# Altium schematic sheet S7CAS-PLEIADES-CARTE-MERE_P20_PLL.SchDoc
size Tabloid; SheetNumber: 14; SheetTotal: 20; Sheet_Name: PLL; Size: 11x17
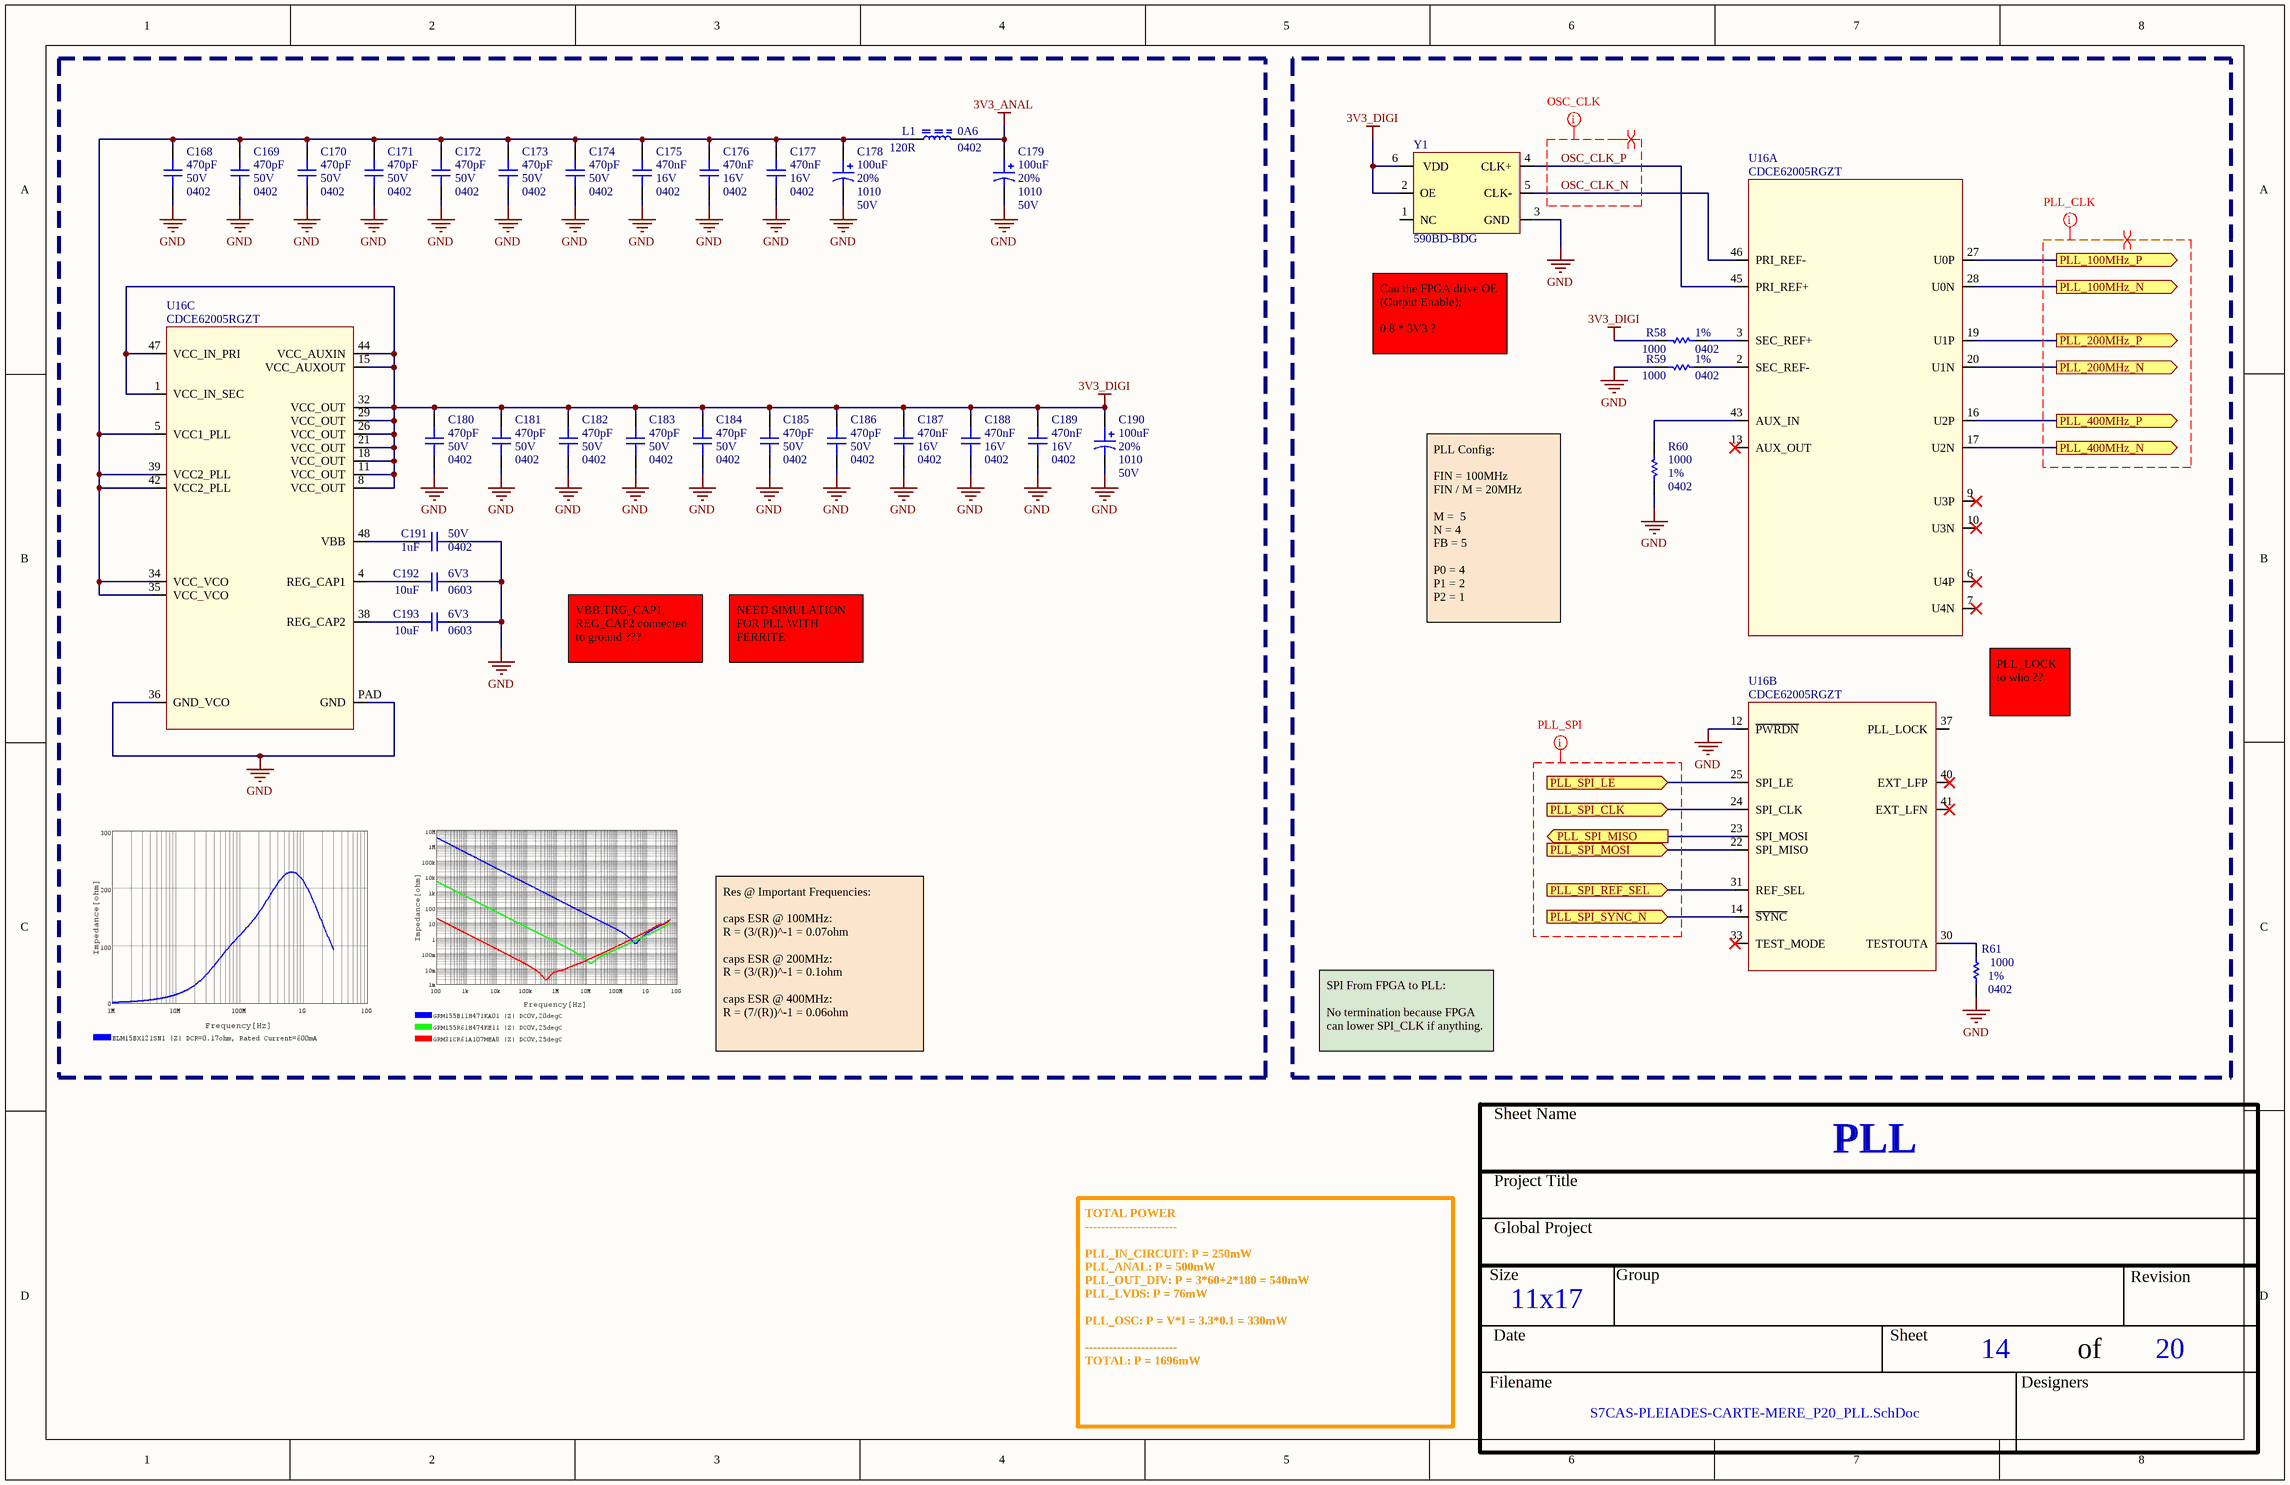
[diagram p0: S7CAS-PLEIADES-CARTE-MERE_P20_PLL.SchDoc]

## Parts
C168  value 470pF  Voltage: 50V  Package: 0402  [CAP_0402]  (hidden comment: CAP - 0402)
C169  value 470pF  Voltage: 50V  Package: 0402  [CAP_0402]  (hidden comment: CAP - 0402)
C170  value 470pF  Voltage: 50V  Package: 0402  [CAP_0402]  (hidden comment: CAP - 0402)
C171  value 470pF  Voltage: 50V  Package: 0402  [CAP_0402]  (hidden comment: CAP - 0402)
C172  value 470pF  Voltage: 50V  Package: 0402  [CAP_0402]  (hidden comment: CAP - 0402)
C173  value 470pF  Voltage: 50V  Package: 0402  [CAP_0402]  (hidden comment: CAP - 0402)
C174  value 470pF  Voltage: 50V  Package: 0402  [CAP_0402]  (hidden comment: CAP - 0402)
C175  value 470nF  Voltage: 16V  Package: 0402  [CAP_0402]  (hidden comment: CAP - 0402)
C176  value 470nF  Voltage: 16V  Package: 0402  [CAP_0402]  (hidden comment: CAP - 0402)
C177  value 470nF  Voltage: 16V  Package: 0402  [CAP_0402]  (hidden comment: CAP - 0402)
C178  value 100uF  Voltage: 50V  Package: 1010  Precision: 20%  [CAP_ALU_1010_vishay]  (hidden comment: MAL215099101E3)
C179  value 100uF  Voltage: 50V  Package: 1010  Precision: 20%  [CAP_ALU_1010_vishay]  (hidden comment: MAL215099101E3)
C180  value 470pF  Voltage: 50V  Package: 0402  [CAP_0402]  (hidden comment: CAP - 0402)
C181  value 470pF  Voltage: 50V  Package: 0402  [CAP_0402]  (hidden comment: CAP - 0402)
C182  value 470pF  Voltage: 50V  Package: 0402  [CAP_0402]  (hidden comment: CAP - 0402)
C183  value 470pF  Voltage: 50V  Package: 0402  [CAP_0402]  (hidden comment: CAP - 0402)
C184  value 470pF  Voltage: 50V  Package: 0402  [CAP_0402]  (hidden comment: CAP - 0402)
C185  value 470pF  Voltage: 50V  Package: 0402  [CAP_0402]  (hidden comment: CAP - 0402)
C186  value 470pF  Voltage: 50V  Package: 0402  [CAP_0402]  (hidden comment: CAP - 0402)
C187  value 470nF  Voltage: 16V  Package: 0402  [CAP_0402]  (hidden comment: CAP - 0402)
C188  value 470nF  Voltage: 16V  Package: 0402  [CAP_0402]  (hidden comment: CAP - 0402)
C189  value 470nF  Voltage: 16V  Package: 0402  [CAP_0402]  (hidden comment: CAP - 0402)
C190  value 100uF  Voltage: 50V  Package: 1010  Precision: 20%  [CAP_ALU_1010_vishay]  (hidden comment: MAL215099101E3)
C191  value 1uF  Voltage: 50V  Package: 0402  [CAP_0402]  (hidden comment: CAP - 0402)
C192  value 10uF  Voltage: 6V3  Package: 0603  [CAP_0603]  (hidden comment: CAP - 0603)
C193  value 10uF  Voltage: 6V3  Package: 0603  [CAP_0603]  (hidden comment: CAP - 0603)
L1  value 120R  Current: 0A6  Package: 0402  [FER_0402]  (hidden comment: FER - 0402)
R58  value 1000  Package: 0402  Precision: 1%  [RES_0402]  (hidden comment: RES - 0402)
R59  value 1000  Package: 0402  Precision: 1%  [RES_0402]  (hidden comment: RES - 0402)
R60  value 1000  Package: 0402  Precision: 1%  [RES_0402]  (hidden comment: RES - 0402)
R61  value 1000  Package: 0402  Precision: 1%  [RES_0402]  (hidden comment: RES - 0402)
U16  CDCE62005RGZT  [TIM_CDCE62005RGZT]  (parts A,B,C of 3)
Y1  590BD-BDG  [OSC_590BD-BDG]

## Ports
PLL_100MHz_N (out), PLL_100MHz_P (out), PLL_200MHz_N (out), PLL_200MHz_P (out), PLL_400MHz_N (out), PLL_400MHz_P (out), PLL_SPI_CLK (in), PLL_SPI_LE (in), PLL_SPI_MISO (out), PLL_SPI_MOSI (in), PLL_SPI_REF_SEL (in), PLL_SPI_SYNC_N (in)

## Nets
3V3_ANAL: C179.1 L1.1
3V3_DIGI: C180.2 C181.2 C182.2 C183.2 C184.2 C185.2 C186.2 C187.2 C188.2 C189.2 C190.1 R58.2 U16.1(VCC_IN_SEC) U16.8(VCC_OUT) U16.11(VCC_OUT) U16.15(VCC_AUXOUT) U16.18(VCC_OUT) U16.21(VCC_OUT) U16.26(VCC_OUT) U16.29(VCC_OUT) U16.32(VCC_OUT) U16.44(VCC_AUXIN) U16.47(VCC_IN_PRI) Y1.2(OE) Y1.6(VDD)
GND: C168.1 C169.1 C170.1 C171.1 C172.1 C173.1 C174.1 C175.1 C176.1 C177.1 C178.2 C179.2 C180.1 C181.1 C182.1 C183.1 C184.1 C185.1 C186.1 C187.1 C188.1 C189.1 C190.2 C191.1 C192.1 C193.1 R59.1 R60.2 R61.1 U16.12(~{PWRDN}) U16.36(GND_VCO) U16.PAD(GND) Y1.3(GND)
OSC_CLK_N: U16.46(PRI_REF-) Y1.5(CLK-)
OSC_CLK_P: U16.45(PRI_REF+) Y1.4(CLK+)
PLL_100MHz_N: U16.28(U0N) ; port PLL_100MHz_N
PLL_100MHz_P: U16.27(U0P) ; port PLL_100MHz_P
PLL_200MHz_N: U16.20(U1N) ; port PLL_200MHz_N
PLL_200MHz_P: U16.19(U1P) ; port PLL_200MHz_P
PLL_400MHz_N: U16.17(U2N) ; port PLL_400MHz_N
PLL_400MHz_P: U16.16(U2P) ; port PLL_400MHz_P
PLL_SPI_CLK: U16.24(SPI_CLK) ; port PLL_SPI_CLK
PLL_SPI_LE: U16.25(SPI_LE) ; port PLL_SPI_LE
PLL_SPI_MISO: U16.23(SPI_MOSI) ; port PLL_SPI_MISO
PLL_SPI_MOSI: U16.22(SPI_MISO) ; port PLL_SPI_MOSI
PLL_SPI_REF_SEL: U16.31(REF_SEL) ; port PLL_SPI_REF_SEL
PLL_SPI_SYNC_N: U16.14(~{SYNC}) ; port PLL_SPI_SYNC_N
NetC168_2: C168.2 C169.2 C170.2 C171.2 C172.2 C173.2 C174.2 C175.2 C176.2 C177.2 C178.1 L1.2 U16.5(VCC1_PLL) U16.34(VCC_VCO) U16.35(VCC_VCO) U16.39(VCC2_PLL) U16.42(VCC2_PLL)
NetC191_2: C191.2 U16.48(VBB)
NetC192_2: C192.2 U16.4(REG_CAP1)
NetC193_2: C193.2 U16.38(REG_CAP2)
NetR58_1: R58.1 U16.3(SEC_REF+)
NetR59_2: R59.2 U16.2(SEC_REF-)
NetR60_1: R60.1 U16.43(AUX_IN)
NetR61_2: R61.2 U16.30(TESTOUTA)

Not connected (* = marked no-connect by the designer): U16 6(U4P)* 7(U4N)* 9(U3P)* 10(U3N)* 13(AUX_OUT)* 33(TEST_MODE)* 37(PLL_LOCK) 40(EXT_LFP)* 41(EXT_LFN)*; Y1 1(NC)

## Layout directives
net class TRACKS_50: (no net found under the mark), OSC_CLK_N, OSC_CLK_P
differential pair: (no net found under the mark), OSC_CLK_N, OSC_CLK_P

## Notes on the sheet
- Can the FPGA drive OE (Output Enable):
  0.8 * 3V3 ?
- PLL Config:
  FIN = 100MHz
  FIN / M = 20MHz
  M =  5
  N = 4
  FB = 5
  P0 = 4
  P1 = 2
  P2 = 1
- VBB,TRG_CAP1, REG_CAP2 connected to ground ???
- NEED SIMULATION FOR PLL WITH FERRITE
- (near U16) PLL_LOCK to who ??
- Res @ Important Frequencies:
  caps ESR @ 100MHz:
  R = (3/(R))^-1 = 0.07ohm
  caps ESR @ 200MHz:
  R = (3/(R))^-1 = 0.1ohm
  caps ESR @ 400MHz:
  R = (7/(R))^-1 = 0.06ohm
- SPI From FPGA to PLL:
  No termination because FPGA can lower SPI_CLK if anything.
- TOTAL POWER
  -----------------------
  PLL_IN_CIRCUIT: P = 250mW
  PLL_ANAL: P = 500mW
  PLL_OUT_DIV: P = 3*60+2*180 = 540mW
  PLL_LVDS: P = 76mW
  PLL_OSC: P = V*I = 3.3*0.1 = 330mW
  -----------------------
  TOTAL: P = 1696mW
- Sheet Name
- Project Title
- Global Project
- Size
- Group
- Revision
- Date
- Sheet
- of
- Filename
- Designers

## Library data of the parts
C168-C174 C180-C186 = CAP - 0402: Mfg Part Number: GRM155B11H471KA01; Precision: 10%; Current: *; CreatedBy: Jonathan Bouchard; Power: *
C175-C177 C187-C189 = CAP - 0402: Mfg Part Number: GXT155R61C474KE01; Precision: 10%; Current: *; CreatedBy: Jonathan Bouchard; Power: *
C178 C179 C190 = CAP_ALU_MAL215099101E3: CAP - ALU 100uF 20% 50V - 1010; Current: 490mA; Mfg: Vishay Dale; Mfg Part Number: MAL215099101E3; HelpURL: http://www.vishay.com/docs/28395/150crz.pdf; CreatedBy: Jonathan Bouchard; Temperature: -55°C to 125°C; Power: *; Supplier 1: Digikey; Supplier Part Number 1: 4399PHDKR-ND
C191 = CAP - 0402: Mfg Part Number: GXT155R61E105KE01; Precision: 10%; Current: *; CreatedBy: Jonathan Bouchard; Power: *
C192 C193 = CAP - 0603: Mfg Part Number: GRM185R60J106ME15; Precision: 20%; Current: *; CreatedBy: Jonathan Bouchard; Power: *
L1 = FER - 0402: Mfg Part Number: BLM15BX121SN1; Voltage: *; CreatedBy: Jonathan Bouchard; Power: *; Precision: *
R58-R61 = RES - 0402: Mfg Part Number: MCS04020C1001FE000; Voltage: 50V; Power: 1/16W; Current: *; CreatedBy: Jonathan Bouchard
U16 = TIM_CDCE62005RGZT: TIM - CLK SYNTH JITTER CLEANER 3:5 - QFN-48; Voltage: 3 V ~ 3.6 V; Mfg: Texas Instruments; Current: *; Power: *; Mfg Part Number: CDCE62005RGZT; HelpURL: http://www.ti.com/lit/ds/symlink/cdce62005.pdf; CreatedBy: Jonathan Bouchard; Temperature: -40°C ~ 85°C; Value: *; Precision: *; Package: QFN-48; Supplier 1: Digikey; Supplier Part Number 1: 296-23947-1-ND
Y1 = OSC_590BD-BDG: TIM - OSC PROG 125MHz ~ 214.999MHz LVDS 3.3V 7PPM EN/DS - 6-SMD; Manufacturer #1: Silicon Labs; Current Rating: 100 mA (supply); Note: Spécifié la fréquence lors de la commande; Voltage rating: 3.3V (supply); Polarized: Yes; Value: ±7ppm (freq Stability), ±20ppm (freq stability total); Magnetic Material: UNKNOWN; GRAMS Lib Spec: 2.8; Manufacturer #2: *; Power Max: *; Part Number #1: 590BD-BDG; Part Number #2: *; HelpURL: https://www.silabs.com/documents/public/data-sheets/Si590-591.pdf; Supplier 1: Digi-Key; Supplier Part Number 1: 590BD-BDG-ND; Assembly Type: SMD; Temperature: -40°C ~ 85°C; Package: 6-SMD; CreatedBy/Date: from 590BD-CDG; Tolerance: *; VerifiedBy: Caroline Paulin / 3/10/2019; Cryo: UNKNOWN